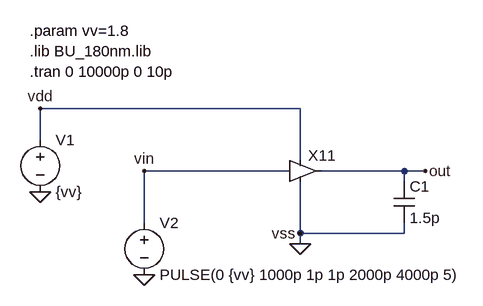
[diagram p0: schematic pad_buffer_test.asc]
pad_buffer_test.asc, the LTspice schematic file:
Version 4
SHEET 1 1168 680
WIRE 64 224 -336 224
WIRE -336 272 -336 224
WIRE 64 304 64 224
WIRE 48 320 -176 320
WIRE 224 320 96 320
WIRE 256 320 224 320
WIRE 224 336 224 320
WIRE -176 400 -176 320
WIRE 64 416 64 336
WIRE 224 416 224 400
WIRE 224 416 64 416
WIRE 64 432 64 416
FLAG -336 352 0
FLAG -176 480 0
FLAG -336 224 vdd
FLAG -176 320 vin
FLAG 256 320 out
FLAG 64 432 0
FLAG 64 416 vss
SYMBOL /voltage -336 256 R0
SYMATTR InstName V1
SYMATTR Value {vv}
SYMBOL /voltage -176 384 R0
SYMATTR InstName V2
SYMATTR Value PULSE(0 {vv} 1000p 1p 1p 2000p 4000p 5)
SYMBOL /cap 208 336 R0
SYMATTR InstName C1
SYMATTR Value 1.5p
SYMBOL pad_buffer 64 320 R0
SYMATTR InstName X11
TEXT -352 104 Left 2 !.param vv=1.8\n.lib BU_180nm.lib\n.tran 0 10000p 0 10p

The netlist it stands for:
* pad_buffer_test.asc
V1 vdd 0 {vv}
V2 vin 0 PULSE(0 {vv} 1000p 1p 1p 2000p 4000p 5)
C1 out 0 1.5p
XX11 vin out vdd 0 pad_buffer  ; pins In out vdd vss
.param vv=1.8
.lib BU_180nm.lib
.tran 0 10000p 0 10p
.backanno
.end